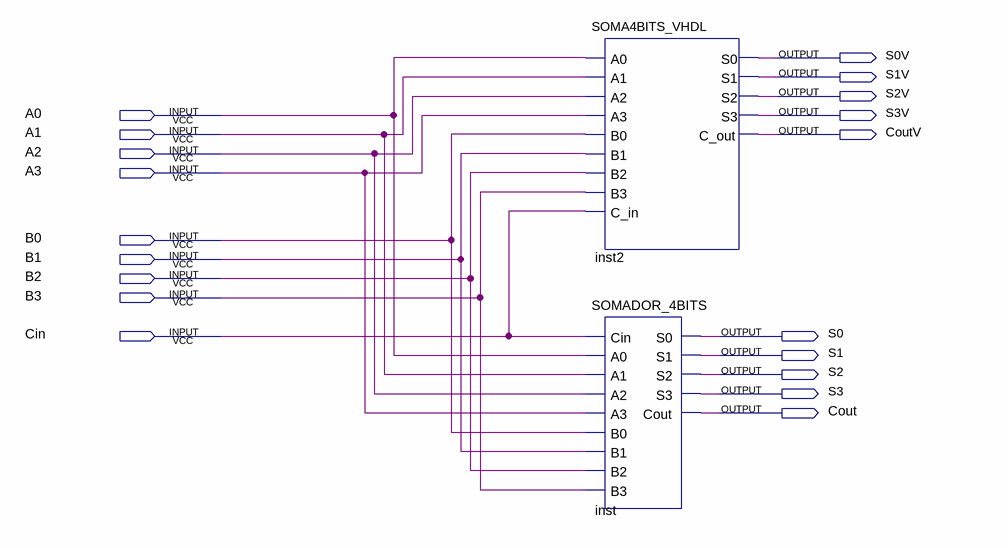
[diagram p0: schematic sheet]
// Quartus schematic SOMADOR_4BITS_7SEG.bdf as structural Verilog: 2 symbols, 19 pins
module SOMADOR_4BITS_7SEG (
  input  A0,
  input  A1,
  input  A2,
  input  A3,
  input  B0,
  input  B1,
  input  B2,
  input  B3,
  input  Cin,
  output S0V,
  output S1V,
  output S2V,
  output S3V,
  output CoutV,
  output S0,
  output S1,
  output S2,
  output S3,
  output Cout
);

  SOMA4BITS_VHDL inst2 (
    .A0(A0), .A1(A1), .A2(A2), .A3(A3), .B0(B0), .B1(B1), .B2(B2), .B3(B3), .C_in(Cin), .S0(S0V), .S1(S1V),
    .S2(S2V), .S3(S3V), .C_out(CoutV));
  SOMADOR_4BITS inst (
    .Cin(Cin), .A0(A0), .A1(A1), .A2(A2), .A3(A3), .B0(B0), .B1(B1), .B2(B2), .B3(B3), .S0(S0), .S1(S1),
    .S2(S2), .S3(S3), .Cout(Cout));
endmodule
